# EAGLE design Cansat2019_3279_Container_v05 (EAGLE 7.3.0)
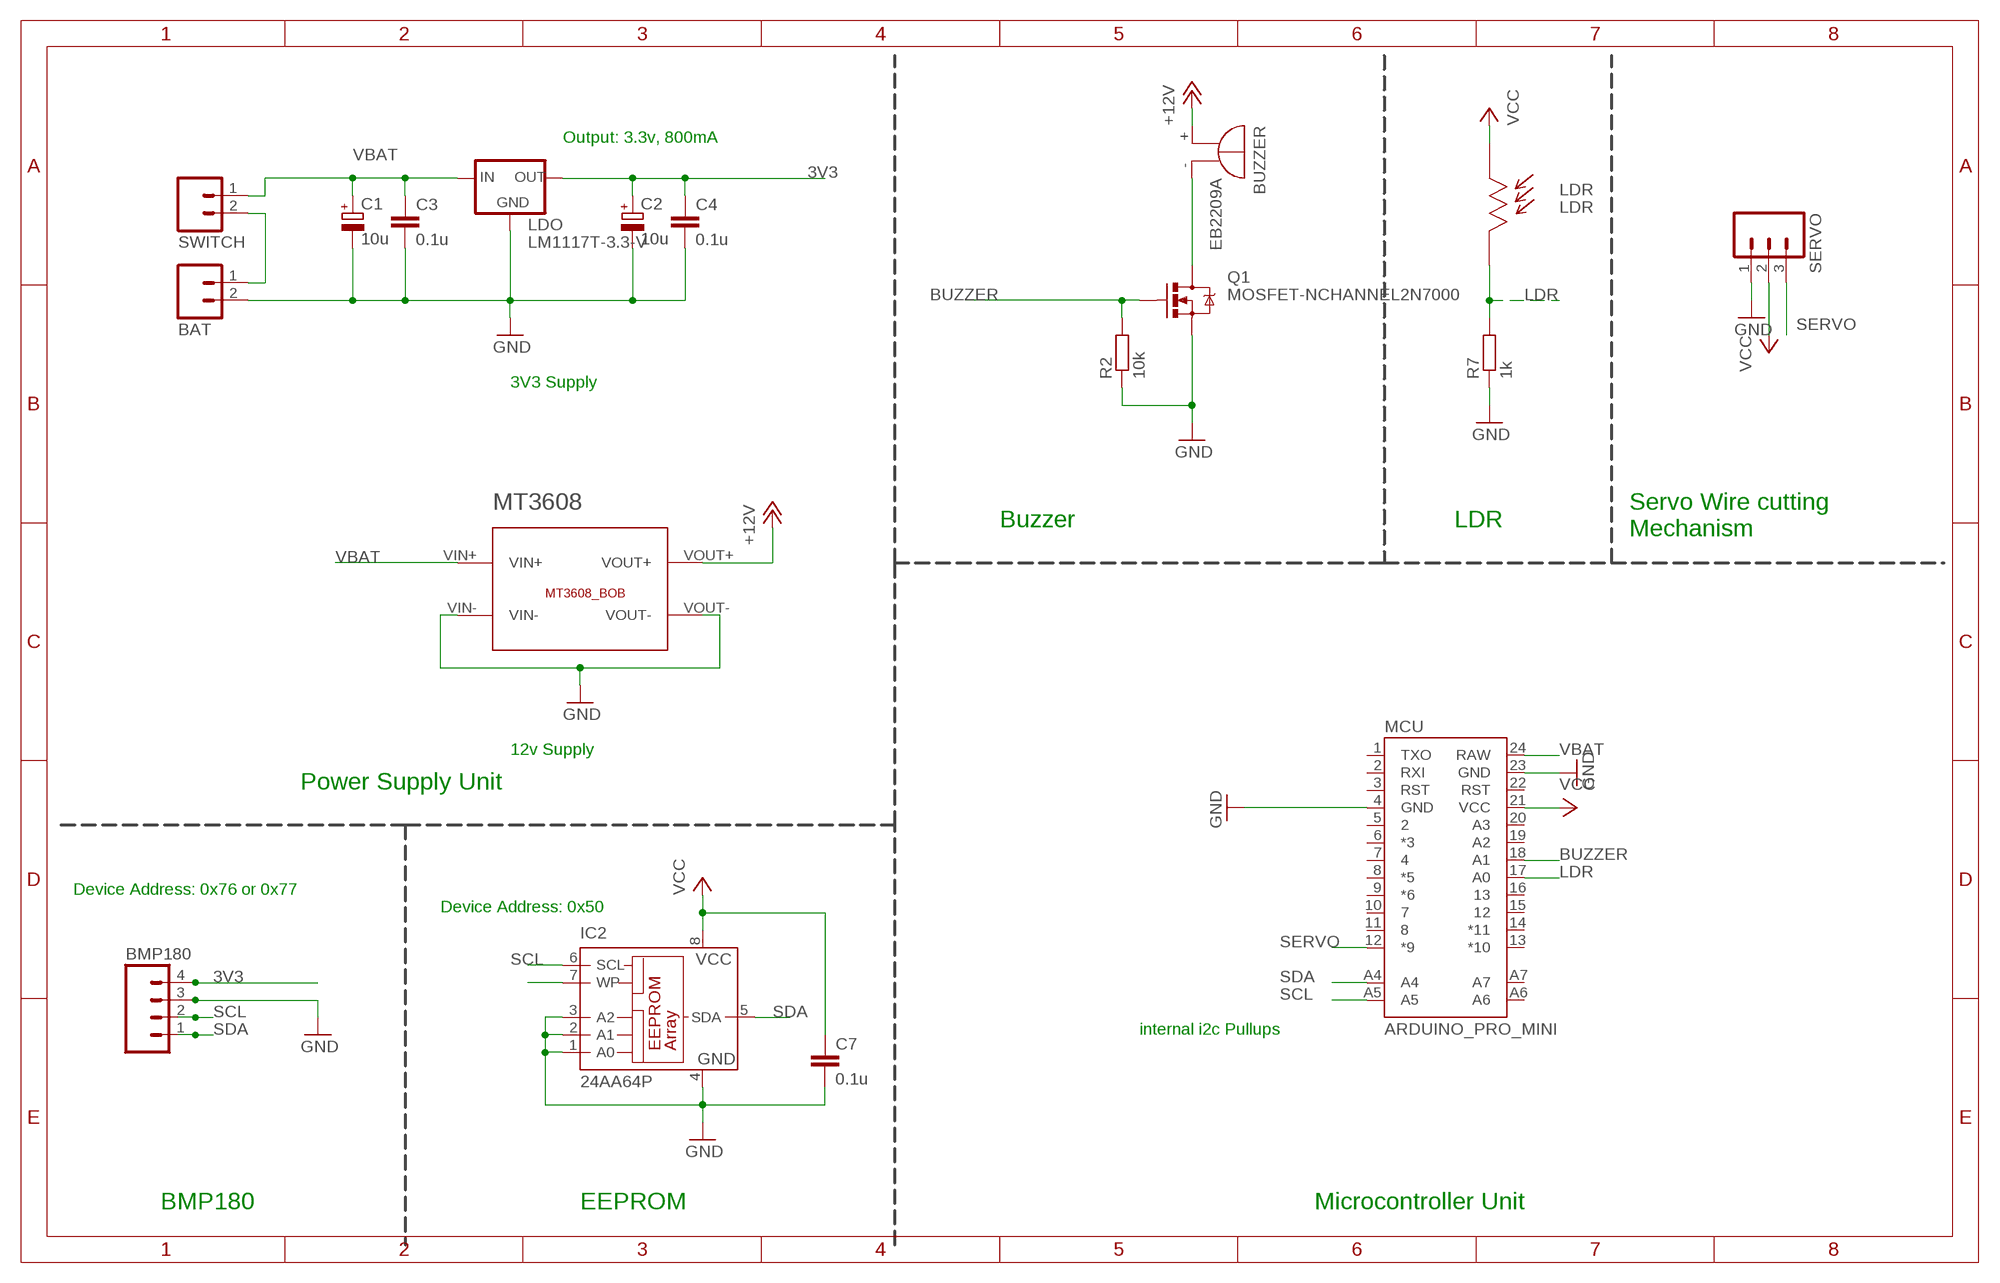
[diagram p0: schematic, sheet 1]

## Parts
BAT  M02  [02P]
BMP180  M04  [04P]
BUZZER  EB2209A  [EB2209A]
C1  10u  CPOL-EUE2.5-6  [E2,5-6]
C2  10u  CPOL-EUE2.5-6  [E2,5-6]
C3  0.1u  C-EU025-025X050  [C025-025X050]
C4  0.1u  C-EU025-025X050  [C025-025X050]
C7  0.1u  C-EU025-025X050  [C025-025X050]
IC2  24AA64P  [DIL8]
LDO  LM1117T-3.3-V  [TO220V]
LDR  LDR  [LDR-5MM]
MCU  ARDUINO_PRO_MINI  [ARDUINO_PRO_MINI]
MT3608  MT3608_BOB  [MT3608_BOB]
Q1  MOSFET-NCHANNEL2N7000  [TO-92]
R2  10k  R-EU_0204/7  [0204/7]
R7  1k  R-EU_0204/7  [0204/7]
SERVO  M03  [03P]
SWITCH  M02  [02P]

## Nets
3V3 [power]: BMP180.4 C2.+ C4.1 LDO.2(OUT)
+12V [power]: BUZZER.+ MT3608.VOUT+
BUZZER: MCU.18(A1) Q1.2(G) R2.2
GND [power]: BAT.2 BMP180.3 C1.- C2.- C3.2 C4.2 C7.2 IC2.1(A0) IC2.2(A1) IC2.3(A2) IC2.4(GND) LDO.1(GND) MCU.4(GND) MCU.23(GND) MT3608.VIN- MT3608.VOUT- Q1.1(S) R2.1 R7.1 SERVO.1
LDR: LDR.P$2 MCU.17(A0) R7.2
N$1 [power]: BUZZER.- Q1.3(D)
N$6 [burner]: BAT.1 SWITCH.2
N$8: IC2.7(WP)
SCL: BMP180.2 IC2.6(SCL) MCU.A5
SDA: BMP180.1 IC2.5(SDA) MCU.A4
SERVO: MCU.12(*9) SERVO.3
VBAT [burner]: C1.+ C3.1 LDO.3(IN) MCU.24(RAW) MT3608.VIN+ SWITCH.1
VCC [power]: C7.1 IC2.8(VCC) LDR.P$1 MCU.21(VCC) SERVO.2
Unconnected: MCU.1(TXO) MCU.2(RXI) MCU.3(RST) MCU.5 MCU.6(*3) MCU.7 MCU.8(*5) MCU.9(*6) MCU.10 MCU.11 MCU.13(*10) MCU.14(*11) MCU.15 MCU.16 MCU.19(A2) MCU.20(A3) MCU.22(RST) MCU.A6 MCU.A7

## Notes on the sheet
- Output: 3.3v, 800mA
- 3V3 Supply
- Buzzer | LDR
- Servo Wire cutting
  Mechanism
- 12v Supply
- Power Supply Unit
- Device Address: 0x76 or 0x77
- Device Address: 0x50
- internal i2c Pullups
- BMP180 | EEPROM | Microcontroller Unit

## Library data of the parts
BAT SWITCH = CEDT_JANUARY_2015_v5:M02: AMP QUICK CONNECTOR
BMP180 = con-amp-quick:M04: AMP QUICK CONNECTOR; OC_FARNELL: unknown; OC_NEWARK: unknown
BUZZER = buzzer:EB2209A: BUZZER Source: Buerklin; OC_FARNELL: unknown; OC_NEWARK: unknown
C1 C2 = rcl:CPOL-EU: POLARIZED CAPACITOR, European symbol
C3 C4 C7 = rcl:C-EU: CAPACITOR, European symbol
IC2 = microchip:24*: Serial EEPROM I2C; MF: MICROCHIP; MPN: 24AA64-I/P; OC_FARNELL: 1331303; OC_NEWARK: 92C6909
LDO = lm1117:LM1117T-*
LDR = msp framework:LDR: Light Dependent Resistor Sunrom Product Page <http://www.sunrom.com/p/ldr-5mm-light-dependent-resistor>; SUNROM: 3190
MCU = SparkFun-Boards - Copy:ARDUINO_PRO_MINI
MT3608 = Breakouts:MT3608_BOB
Q1 = SparkFun-DiscreteSemi:MOSFET-NCHANNEL: Common NMOSFET Parts MFG P/N Store ID Prod ID FDD8780 TRANS-09984 SI7820DN TRANS-11055 FDS6630A IC-08089 2N7002PW TRANS-11151 FQP30N06L COM-10213 TRANS-10060 BSS123LT1G TRANS-08345 BSS138 TRANS-00830 BS170 2N7000
R2 R7 = rcl:R-EU_: RESISTOR, European symbol
SERVO = msp framework:M03: AMP QUICK CONNECTOR

## Net classes
0 default: width 0.406 mm
1 power: width 0.61 mm, clearance 0.305 mm
2 burner: width 0.813 mm, clearance 0.305 mm

## Board
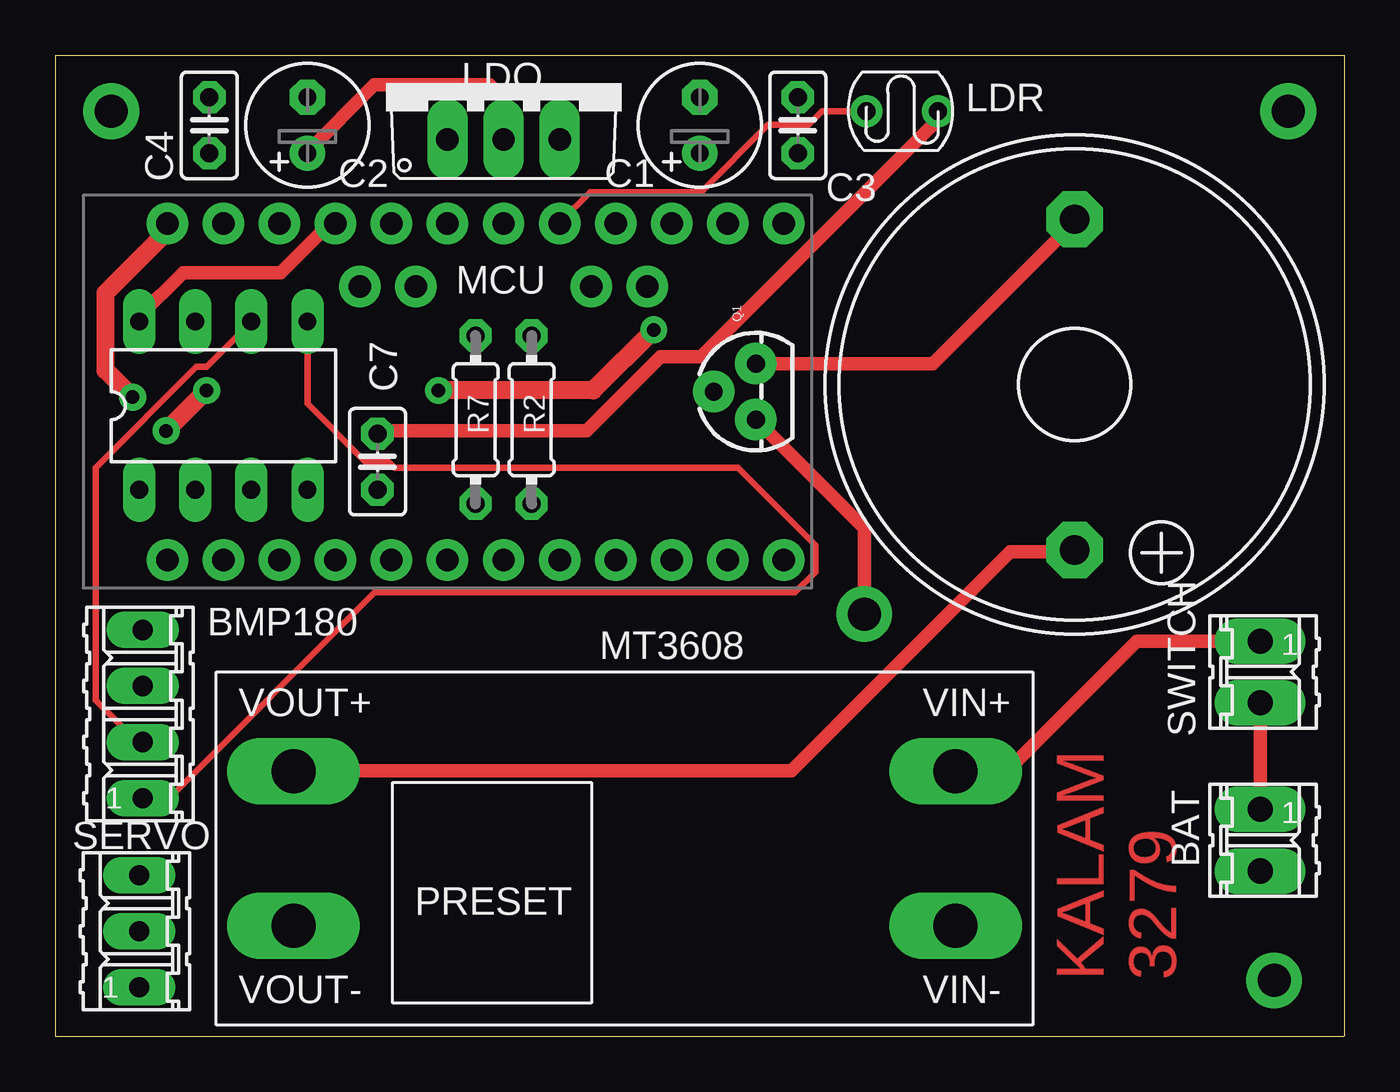
[diagram p1: board, top side]
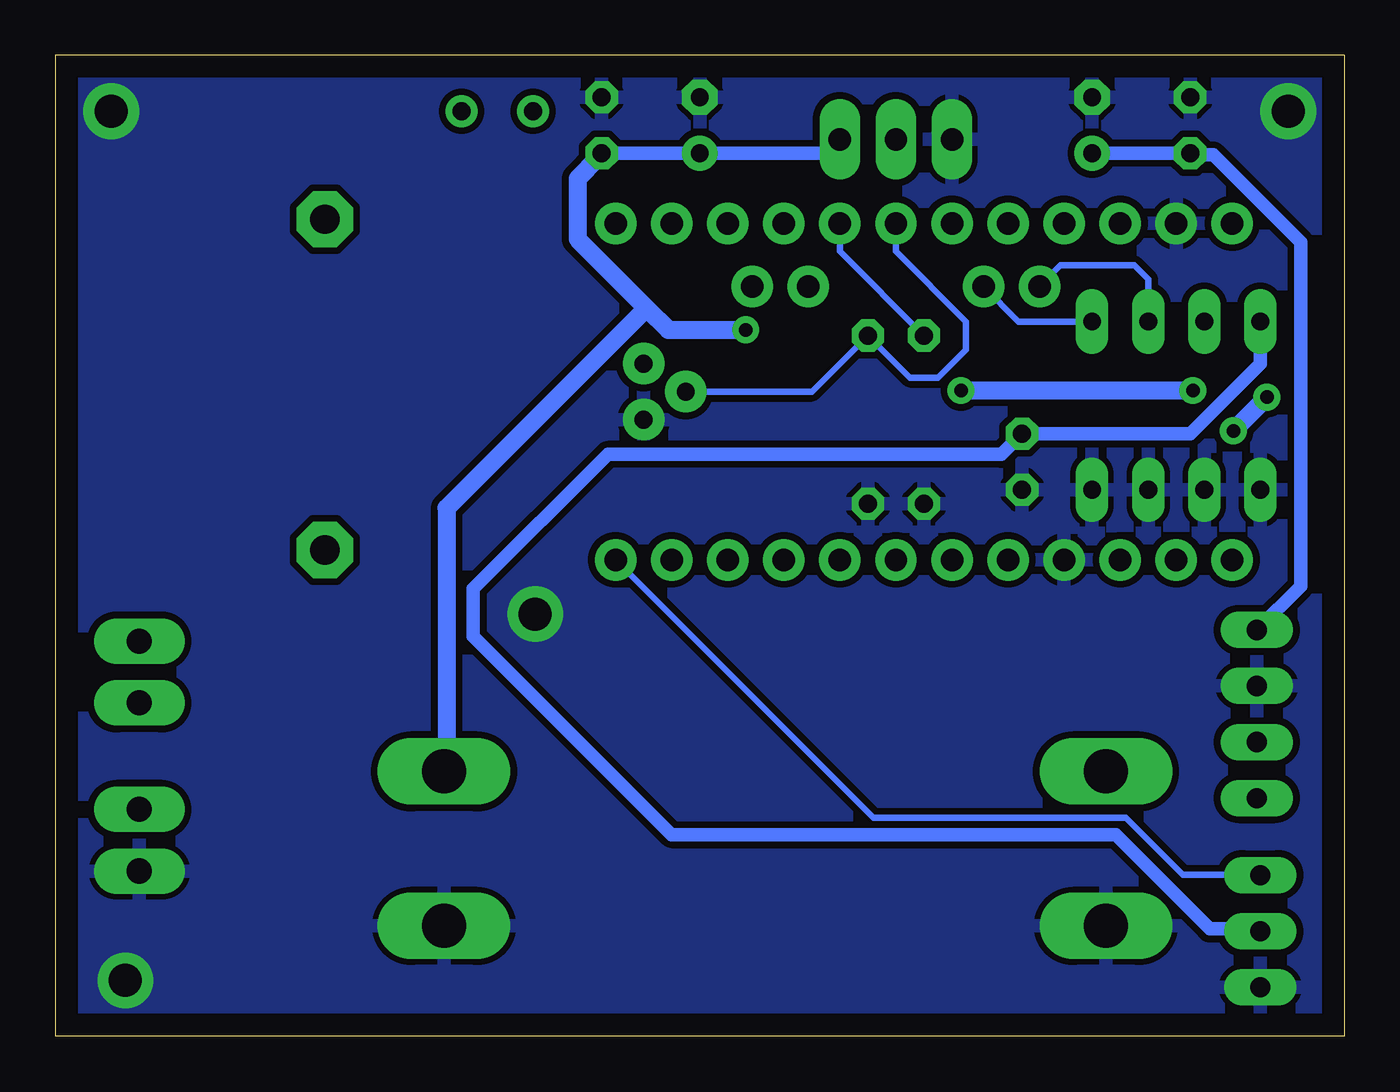
[diagram p2: board, bottom side, seen from below]

Size 58.42 x 44.45 mm. Coordinates in mm from the lower left corner, seen from the top.
Outline: 58.4,0 0,0 0,44.44
Outline: 0,44.45 58.42,44.45 58.42,0
Copper layers (1*16): Top 0.035mm / dielectric 1.5mm / Bottom 0.035mm
Design rules "8085_board": minimum track width 10mil, minimum drill 24mil, track to track 8mil, track to pad 8mil, pad to pad 8mil, via to via 8mil, smd to smd 8mil, copper to edge 40mil, drill to drill 8mil, minimum pad ring 12mil, minimum via ring 12mil, stop-mask expansion 4mil, vias tented up to drill 0mil, thermal gap 10mil

### Footprints (pad centres in the part's own frame; a part is rotated, then mirrored left to right if it is on the bottom)
02P = drill 1.143 long: 1 -1.397,0; 2 1.397,0
04P = drill 0.914 long: 1 -3.81,0; 2 -1.27,0; 3 1.27,0; 4 3.81,0
EB2209A = drill 1.321 pad 2.54 octagon: + 7.493,0; - -7.493,0
E2,5-6 = drill 0.813 pad 1.6: + -1.27,0 | drill 0.813 pad 1.6 octagon: - 1.27,0
C025-025X050 = drill 0.813 octagon: 1 -1.27,0; 2 1.27,0
DIL8 = drill 0.813 long: 1 -3.81,-3.81; 2 -1.27,-3.81; 3 1.27,-3.81; 4 3.81,-3.81; 5 3.81,3.81; 6 1.27,3.81; 7 -1.27,3.81; 8 -3.81,3.81
TO220V = drill 1.016 long: 1 -2.54,-2.54; 2 0,-2.54; 3 2.54,-2.54
LDR-5MM = drill 0.8: P$1 0,0; P$2 3.24,0
ARDUINO_PRO_MINI = drill 1.016 pad 1.88: 1 -7.62,12.7; 2 -7.62,10.16; 3 -7.62,7.62; 4 -7.62,5.08; 5 -7.62,2.54; 6 -7.62,0; 7 -7.62,-2.54; 8 -7.62,-5.08; 9 -7.62,-7.62; 10 -7.62,-10.16; 11 -7.62,-12.7; 12 -7.62,-15.24; 13 7.62,-15.24; 14 7.62,-12.7; 15 7.62,-10.16; 16 7.62,-7.62; 17 7.62,-5.08; 18 7.62,-2.54; 19 7.62,0; 20 7.62,2.54; 21 7.62,5.08; 22 7.62,7.62; 23 7.62,10.16; 24 7.62,12.7; A4 4.763,1.429; A5 4.763,3.969; A6 4.763,-9.049; A7 4.763,-6.509
MT3608_BOB = drill 2 pad 3 long: VIN+ 33.5,-4.5; VIN- 33.5,-11.5; VOUT+ 3.5,-4.5; VOUT- 3.5,-11.5
TO-92 = drill 0.813 pad 1.88: 1 -1.27,0; 2 0,1.905; 3 1.27,0
0204/7 = drill 0.813 octagon: 1 -3.81,0; 2 3.81,0
03P = drill 0.914 long: 1 -2.54,0; 2 0,0; 3 2.54,0

### Placement (x,y rotation side)
BAT  54.61,8.89 270 top
BMP180  3.97,14.61 90 top
BUZZER  46.2,29.53 270 top
C1  29.21,41.27 90 top
C2  11.43,41.27 90 top
C3  33.66,41.27 90 top
C4  6.99,41.27 90 top
C7  14.61,26.04 270 top
IC2  7.62,28.57 0 top
LDO  20.32,43.18 0 top
LDR  40.01,41.91 180 top
MCU  17.78,29.21 90 top
MT3608  7.3,16.51 0 top
Q1  31.75,29.21 90 top
R2  21.59,27.94 90 top
R7  19.05,27.94 90 top
SERVO  3.81,4.76 90 top
SWITCH  54.61,16.51 270 top

### Tracks (layer width: path | path; a pad name or v marks a point on that pad's centre or on a via)
3V3
  Top 0.61: LDO.2 20.32,42.47 19.68,43.1 14.45,43.1 11.43,40.08 C2.+
  Bottom 0.61: C2.+ C4.1 6.71,39.93 5.94,39.93 1.98,35.97 1.98,20.4 BMP180.4
+12V
  Top 0.61: BUZZER.+ 46.18,21.95 43.28,21.95 33.38,12.04 10.82,12.04 MT3608.VOUT+
BUZZER
  Bottom 0.305: Q1.2 24.13,29.21 R2.2 19.68,29.84 18.41,29.84 17.14,31.11 17.14,32.38 20.32,35.56 MCU.18
GND  (via drill 1.5)
  Top 0.406: 36.67,19.21 v36.67,19.13
  Top 0.61: 36.67,19.21 36.67,23.02 Q1.1
  other vias: 2.54,41.91 55.88,41.91 55.24,2.54
  pour Bottom: -0.64,46.35 59.05,46.35 59.05,0 -0.64,0
LDR
  Top 0.305: LDR.P$2 34.75,41.91 34.14,41.3 32.31,41.3 29.26,38.25 24.23,38.25 22.86,36.88 MCU.17
  Bottom 0.305: R7.2 22.86,35.56 MCU.17
N$1
  Top 0.61: Q1.3 39.78,30.48 46.18,36.88 BUZZER.-
N$6
  Top 0.61: BAT.1 SWITCH.2
SCL
  Top 0.305: BMP180.2 3.96,13.41 3.66,13.41 1.83,15.24 1.83,25.76 6.4,30.33 6.86,30.33 8.84,32.31 IC2.6
  Bottom 0.305: IC2.6 8.89,34.29 9.53,34.92 12.86,34.92 MCU.A5
SDA
  Top 0.305: IC2.5 11.43,28.65 14.02,26.06 15.09,26.06 15.39,25.76 30.94,25.76 34.44,22.25 34.44,21.03 33.53,20.12 14.48,20.12 5.18,10.82 4.12,10.82 BMP180.1
  Bottom 0.305: IC2.5 14.76,32.38 MCU.A4
SERVO
  Bottom 0.305: MCU.12 21.34,9.91 9.91,9.91 7.32,7.32 3.81,7.32 SERVO.3
VBAT  (via drill 0.61)
  Top 0.61: SWITCH.1 49.02,17.91 43.18,12.06 40.86,12.06 MT3608.VIN+
  Top 0.813: v3.5,28.96 2.29,30.18 2.29,33.68 5.03,36.42 5.03,36.73 MCU.24 | v6.86,29.26 v5.03,27.43 | v17.37,29.26 24.38,29.26 v27.13,32
  Bottom 0.61: C3.1 C1.+ 23.5,40.01 LDO.3
  Bottom 0.813: v5.03,27.43 v3.5,28.96 | v17.37,29.26 v6.86,29.26 | v27.13,32 30.63,32 31.62,32.99 | 31.62,32.99 34.75,36.12 34.75,38.86 33.83,39.78 C3.1 | 31.62,32.99 40.69,23.93 40.69,12.04 MT3608.VIN+
VCC
  Top 0.61: IC2.8 3.81,32.61 5.79,34.59 10.21,34.59 12.34,36.73 12.65,36.73 MCU.21 | LDR.P$1 39.93,41.91 39.93,41.45 29.26,30.79 27.43,30.79 24.08,27.43 14.63,27.43 C7.1
  Bottom 0.61: IC2.8 3.81,30.48 6.99,27.3 C7.1 15.54,26.36 33.38,26.36 39.47,20.27 39.47,18.14 30.48,9.14 10.36,9.14 6.1,4.88 3.81,4.88 SERVO.2

### Text on the board
Top: KALAM / 3279
tStop: KALAM / 3279